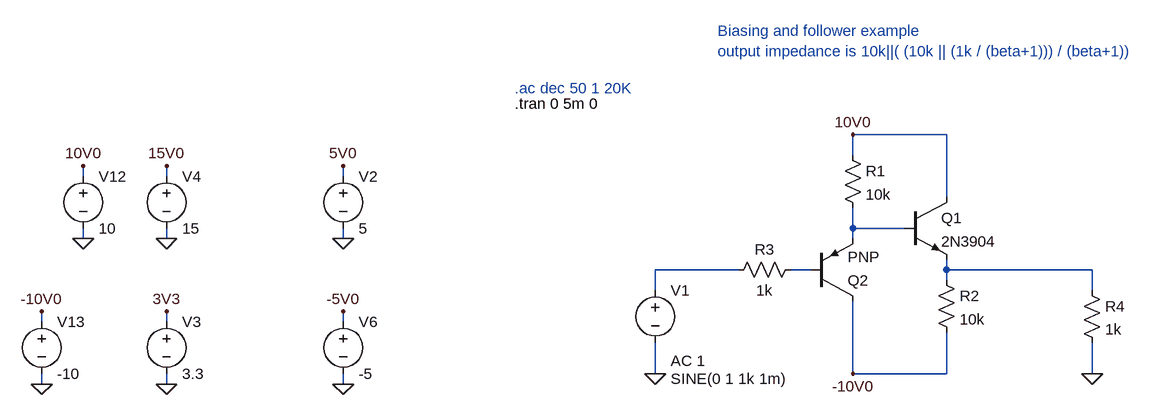
[diagram p0: schematic amp_bias_example_2.asc]
amp_bias_example_2.asc, the LTspice schematic file:
Version 4
SHEET 1 4136 1636
WIRE 592 320 448 320
WIRE 448 352 448 320
WIRE -736 384 -736 368
WIRE -608 384 -608 368
WIRE -336 384 -336 368
WIRE 592 416 592 320
WIRE 448 464 448 432
WIRE 528 464 448 464
WIRE -736 480 -736 464
WIRE -608 480 -608 464
WIRE -336 480 -336 464
WIRE 448 480 448 464
WIRE 272 528 144 528
WIRE 384 528 352 528
WIRE 592 528 592 512
WIRE 816 528 592 528
WIRE 592 544 592 528
WIRE 144 560 144 528
WIRE 816 560 816 528
WIRE -800 608 -800 592
WIRE -608 608 -608 592
WIRE -336 608 -336 592
WIRE 144 688 144 640
WIRE 448 688 448 576
WIRE 592 688 592 624
WIRE 592 688 448 688
WIRE 816 688 816 640
WIRE -800 704 -800 688
WIRE -608 704 -608 688
WIRE -336 704 -336 688
FLAG -336 480 0
FLAG -336 368 5V0
FLAG -608 480 0
FLAG -608 368 15V0
FLAG -336 704 0
FLAG -336 592 -5V0
FLAG -608 704 0
FLAG -608 592 3V3
FLAG -736 480 0
FLAG -736 368 10V0
FLAG -800 704 0
FLAG -800 592 -10V0
FLAG 144 688 0
FLAG 448 320 10V0
FLAG 448 688 -10V0
FLAG 816 688 0
SYMBOL voltage -336 368 R0
WINDOW 123 0 0 Left 0
WINDOW 39 0 0 Left 0
SYMATTR InstName V2
SYMATTR Value 5
SYMBOL voltage -608 368 R0
WINDOW 123 0 0 Left 0
WINDOW 39 0 0 Left 0
SYMATTR InstName V4
SYMATTR Value 15
SYMBOL voltage -336 592 R0
WINDOW 123 0 0 Left 0
WINDOW 39 0 0 Left 0
SYMATTR InstName V6
SYMATTR Value -5
SYMBOL voltage -608 592 R0
WINDOW 123 0 0 Left 0
WINDOW 39 0 0 Left 0
SYMATTR InstName V3
SYMATTR Value 3.3
SYMBOL voltage -736 368 R0
WINDOW 123 0 0 Left 0
WINDOW 39 0 0 Left 0
SYMATTR InstName V12
SYMATTR Value 10
SYMBOL voltage -800 592 R0
WINDOW 123 0 0 Left 0
WINDOW 39 0 0 Left 0
SYMATTR InstName V13
SYMATTR Value -10
SYMBOL voltage 144 544 R0
WINDOW 3 24 152 Left 2
WINDOW 123 24 124 Left 2
WINDOW 39 0 0 Left 0
SYMATTR Value SINE(0 1 1k 1m)
SYMATTR Value2 AC 1
SYMATTR InstName V1
SYMBOL npn 528 416 R0
SYMATTR InstName Q1
SYMATTR Value 2N3904
SYMBOL pnp 384 576 M180
SYMATTR InstName Q2
SYMBOL res 432 336 R0
SYMATTR InstName R1
SYMATTR Value 10k
SYMBOL res 576 528 R0
SYMATTR InstName R2
SYMATTR Value 10k
SYMBOL res 368 512 R90
WINDOW 0 0 56 VBottom 2
WINDOW 3 32 56 VTop 2
SYMATTR InstName R3
SYMATTR Value 1k
SYMBOL res 800 544 R0
SYMATTR InstName R4
SYMATTR Value 1k
TEXT -72 248 Left 2 ;.ac dec 50 1 20K
TEXT -72 272 Left 2 !.tran 0 5m 0
TEXT 240 160 Left 2 ;Biasing and follower example\noutput impedance is 10k||( (10k || (1k / (beta+1))) / (beta+1))

The netlist it stands for:
* amp_bias_example_2.asc
V2 5V0 0 5
V4 15V0 0 15
V6 -5V0 0 -5
V3 3V3 0 3.3
V12 10V0 0 10
V13 -10V0 0 -10
V1 N002 0 SINE(0 1 1k 1m) AC 1
Q1 10V0 N001 N004 0 2N3904
Q2 -10V0 N003 N001 0 PNP
R1 10V0 N001 10k
R2 N004 -10V0 10k
R3 N003 N002 1k
R4 N004 0 1k
.model NPN NPN
.model PNP PNP
.lib standard.bjt
* .ac dec 50 1 20K
.tran 0 5m 0
* Biasing and follower example
* output impedance is 10k||( (10k || (1k / (beta+1))) / (beta+1))
.backanno
.end